# Altium schematic sheet soqueteESP32.SchDoc
size A4; SheetNumber: 3; SheetTotal: 3
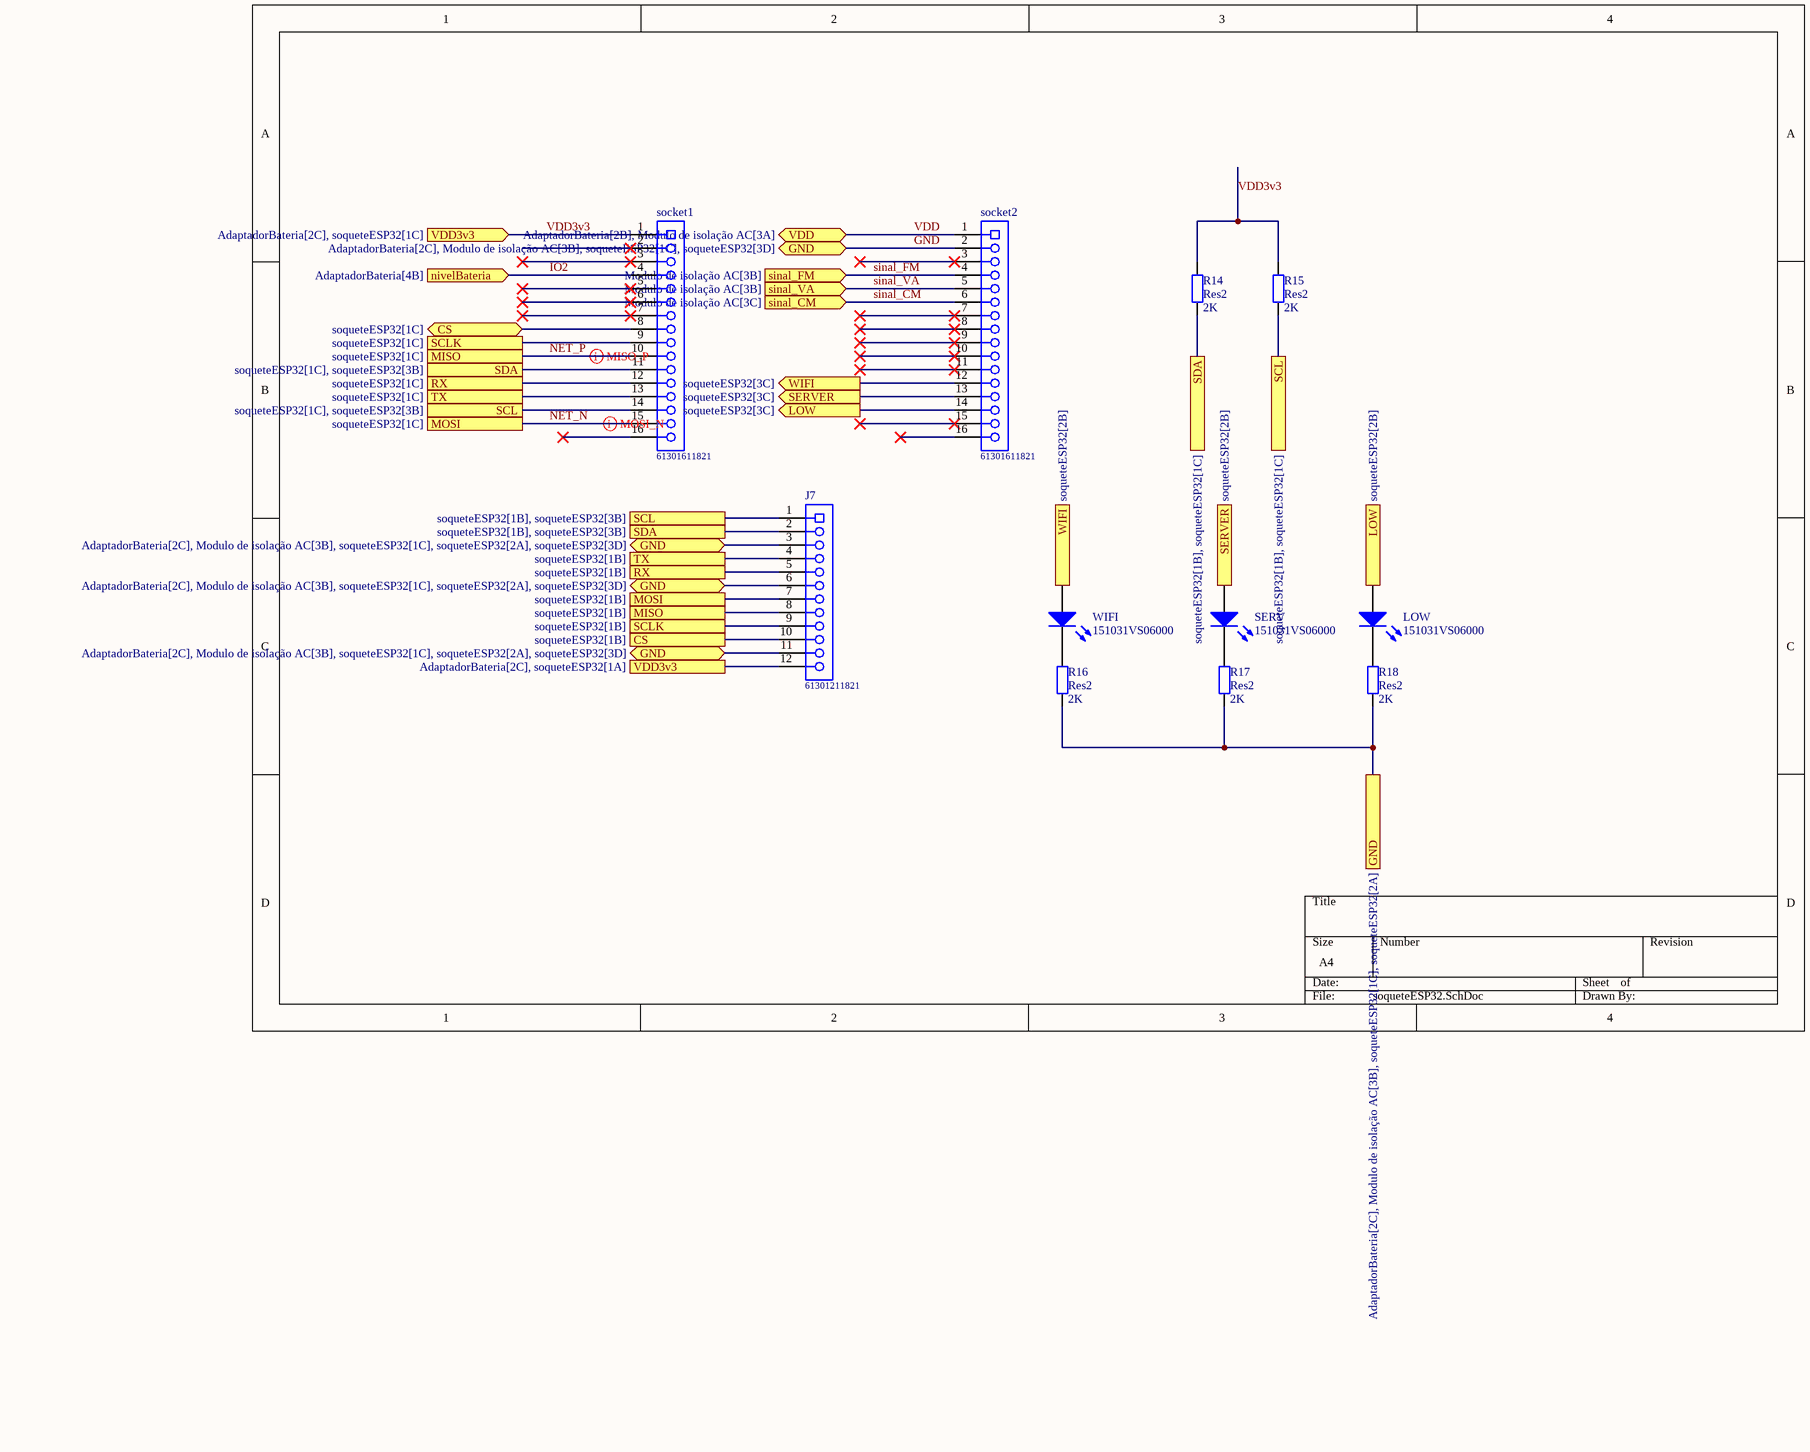
[diagram p0: soqueteESP32.SchDoc]

## Parts
J7  61301211821  [61301211821]
LOW  151031VS06000  [Type 3mm]
R14  Res2  value 2K  [AXIAL-0.4]
R15  Res2  value 2K  [AXIAL-0.4]
R16  Res2  value 2K  [AXIAL-0.4]
R17  Res2  value 2K  [AXIAL-0.4]
R18  Res2  value 2K  [AXIAL-0.4]
SERV  151031VS06000  [Type 3mm]
socket1  61301611821  [61301611821]
socket2  61301611821  [61301611821]
WIFI  151031VS06000  [Type 3mm]

## Ports
CS (bidir, see soqueteESP32[1C]), CS (see soqueteESP32[1B]), GND (bidir, see AdaptadorBateria[2C], Modulo de isolação AC[3B], soqueteESP32[1C], soqueteESP32[2A], soqueteESP32[3D]), GND (bidir, see AdaptadorBateria[2C], Modulo de isolação AC[3B], soqueteESP32[1C], soqueteESP32[3D]), GND (see AdaptadorBateria[2C], Modulo de isolação AC[3B], soqueteESP32[1C], soqueteESP32[2A]), LOW (in, see soqueteESP32[2B]), LOW (out, see soqueteESP32[3C]), MISO (see soqueteESP32[1B]), MISO (see soqueteESP32[1C]), MOSI (see soqueteESP32[1B]), MOSI (see soqueteESP32[1C]), nivelBateria (in, see AdaptadorBateria[4B]), RX (see soqueteESP32[1B]), RX (see soqueteESP32[1C]), SCL (see soqueteESP32[1B], soqueteESP32[1C]), SCL (see soqueteESP32[1B], soqueteESP32[3B]), SCL (see soqueteESP32[1C], soqueteESP32[3B]), SCLK (see soqueteESP32[1B]), SCLK (see soqueteESP32[1C]), SDA (see soqueteESP32[1B], soqueteESP32[1C]), SDA (see soqueteESP32[1B], soqueteESP32[3B]), SDA (see soqueteESP32[1C], soqueteESP32[3B]), SERVER (in, see soqueteESP32[2B]), SERVER (out, see soqueteESP32[3C]), sinal_CM (in, see Modulo de isolação AC[3C]), sinal_FM (in, see Modulo de isolação AC[3B]), sinal_VA (in, see Modulo de isolação AC[3B]), TX (see soqueteESP32[1B]), TX (see soqueteESP32[1C]), VDD3v3 (in, see AdaptadorBateria[2C], soqueteESP32[1C]), VDD3v3 (see AdaptadorBateria[2C], soqueteESP32[1A]), VDD (bidir, see AdaptadorBateria[2B], Modulo de isolação AC[3A]), WIFI (in, see soqueteESP32[2B]), WIFI (out, see soqueteESP32[3C])

## Nets
CS: J7.10 socket1.8 ; port CS
GND: J7.3 J7.6 J7.11 R16.1 R17.1 R18.1 socket2.2 ; port GND
IO2: socket1.4 ; port nivelBateria
LOW: LOW.2(A) socket2.14 ; port LOW
NET_N: J7.7 socket1.15 ; port MOSI
NET_P: J7.8 socket1.10 ; port MISO
RX: J7.5 socket1.12 ; port RX
SCL: J7.1 R15.1 socket1.14 ; port SCL
SCLK: J7.9 socket1.9 ; port SCLK
SDA: J7.2 R14.1 socket1.11 ; port SDA
SERVER: SERV.2(A) socket2.13 ; port SERVER
sinal_CM: socket2.6 ; port sinal_CM
sinal_FM: socket2.4 ; port sinal_FM
sinal_VA: socket2.5 ; port sinal_VA
TX: J7.4 socket1.13 ; port TX
VDD: socket2.1 ; port VDD
VDD3v3: J7.12 R14.2 R15.2 socket1.1 ; port VDD3v3
WIFI: socket2.12 WIFI.2(A) ; port WIFI
NetLOW_1: LOW.1(K) R18.2
NetR16_2: R16.2 WIFI.1(K)
NetR17_2: R17.2 SERV.1(K)

Not connected (* = marked no-connect by the designer): socket1 2* 3* 5* 6* 7* 16*; socket2 3* 7* 8* 9* 10* 11* 15* 16*

## Layout directives
differential pair: NET_N, NET_P

## Library data of the parts
J7 = CMP-1502-01337-1: THT Vertical Socket Header WR-PHD, Pitch 2.54 mm, Single Row, 12 pins; Manufacturer: Wurth Elektronik; Gender: Female; Pin Number: 12; Withstanding Voltage: 500VAC; Working Voltage: 250VAC; Rated Current: 3A; Contact Resistance: 20mOhm; Pitch: 2.54mm; Package Reference: 61301211821; Manufacturer URL: http://www.we-online.de; Datasheet URL: https://katalog.we-online.de/em/datasheet/6130xx11821.pdf; Publisher: WurthElektronik; Orientation: Vertical; Mounting Technology: THT; Operating Temperature: -40to125degC; Part Number: 61301211821; Packaging: Tray; Row Number: Single
LOW SERV WIFI = CMP-1488-00004-1: THT LED round mono-color color lens, WL-TMRC , Bright Green; Manufacturer: Wuerth Elektronik; ComponentLink2Description: Datasheet; ComponentLink1URL: http://www.we-online.com; PartNumber: 151031VS06000; ComponentLink2URL: http://katalog.we-online.de/pbs/datasheet/7448042001.pdfhttp://katalog.we-online.de/pbs/datasheet/7448042001.pdfhttp://katalog.we-online.de/pbs/datasheet/7448042001.pdfhttp://katalog.we-online.de/pbs/datasheet/151031VS06000.pdf; ComponentLink1Description: Manufacturer URL; Emitting color: Bright Green; PackageReference: Type 3mm
R14-R18 = Res2: Resistor; Published: 8-Jun-2000; LatestRevisionDate: 17-Jul-2002; LatestRevisionNote: Re-released for DXP Platform.; PackageReference: AXIAL-0.4; Publisher: Altium Limited; PackageDescription: Axial Device, Thru-Hole; 2 Leads; 0.4 in Pin Spacing
socket1 socket2 = CMP-1502-01343-1: THT Vertical Socket Header WR-PHD, Pitch 2.54 mm, Single Row, 16 pins; Manufacturer: Wurth Elektronik; Working Voltage: 250VAC; Pin Number: 16; Gender: Female; Withstanding Voltage: 500VAC; Rated Current: 3A; Contact Resistance: 20mOhm; Pitch: 2.54mm; Operating Temperature: -40to125degC; Manufacturer URL: http://www.we-online.de; Mounting Technology: THT; Part Number: 61301611821; Datasheet URL: https://katalog.we-online.de/em/datasheet/6130xx11821.pdf; Publisher: WurthElektronik; Row Number: Single; Orientation: Vertical; Packaging: Tray; Package Reference: 61301611821